# EasyEDA Pro project XRAY.epro, board PCB
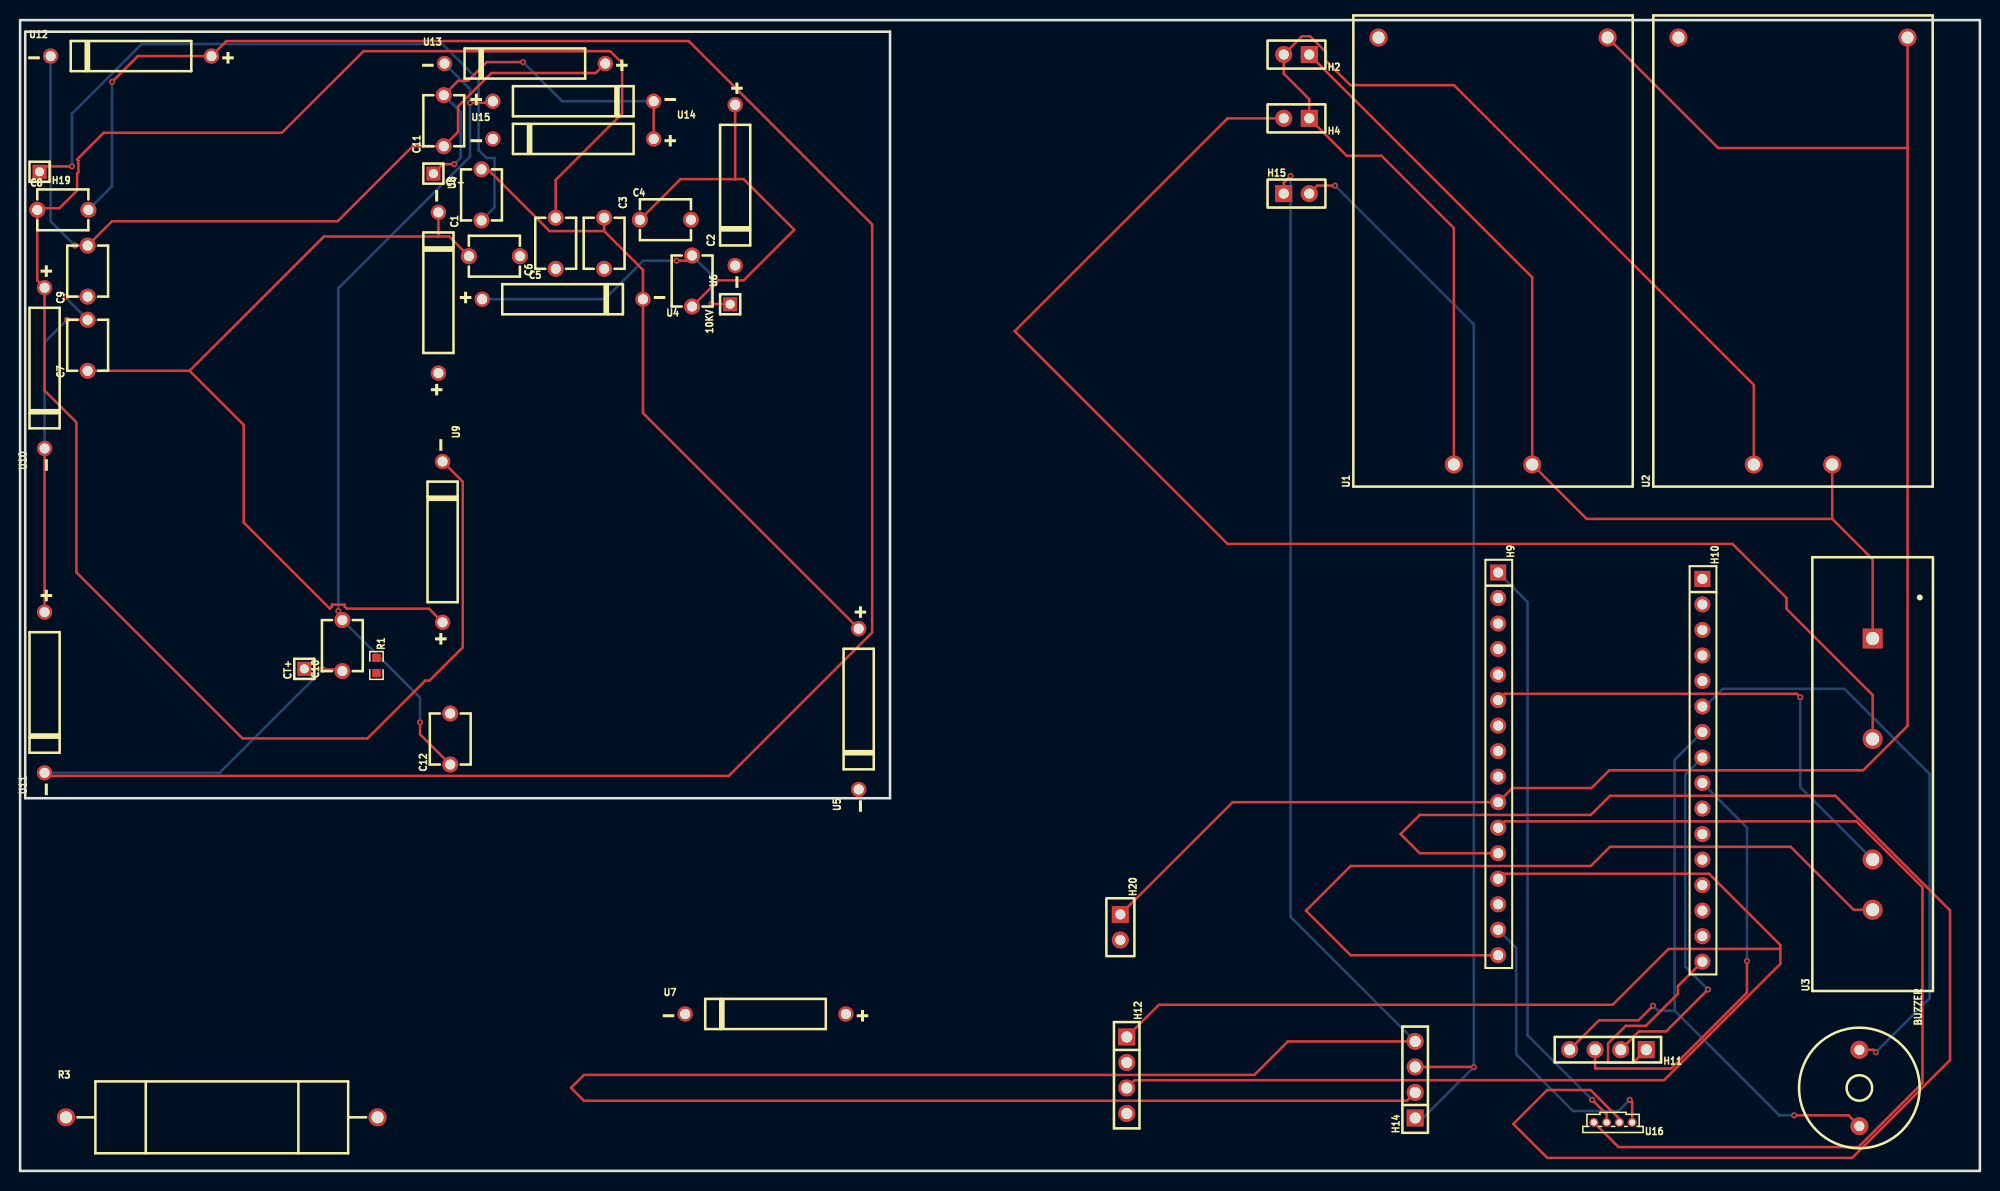
[diagram p7: board, top side]
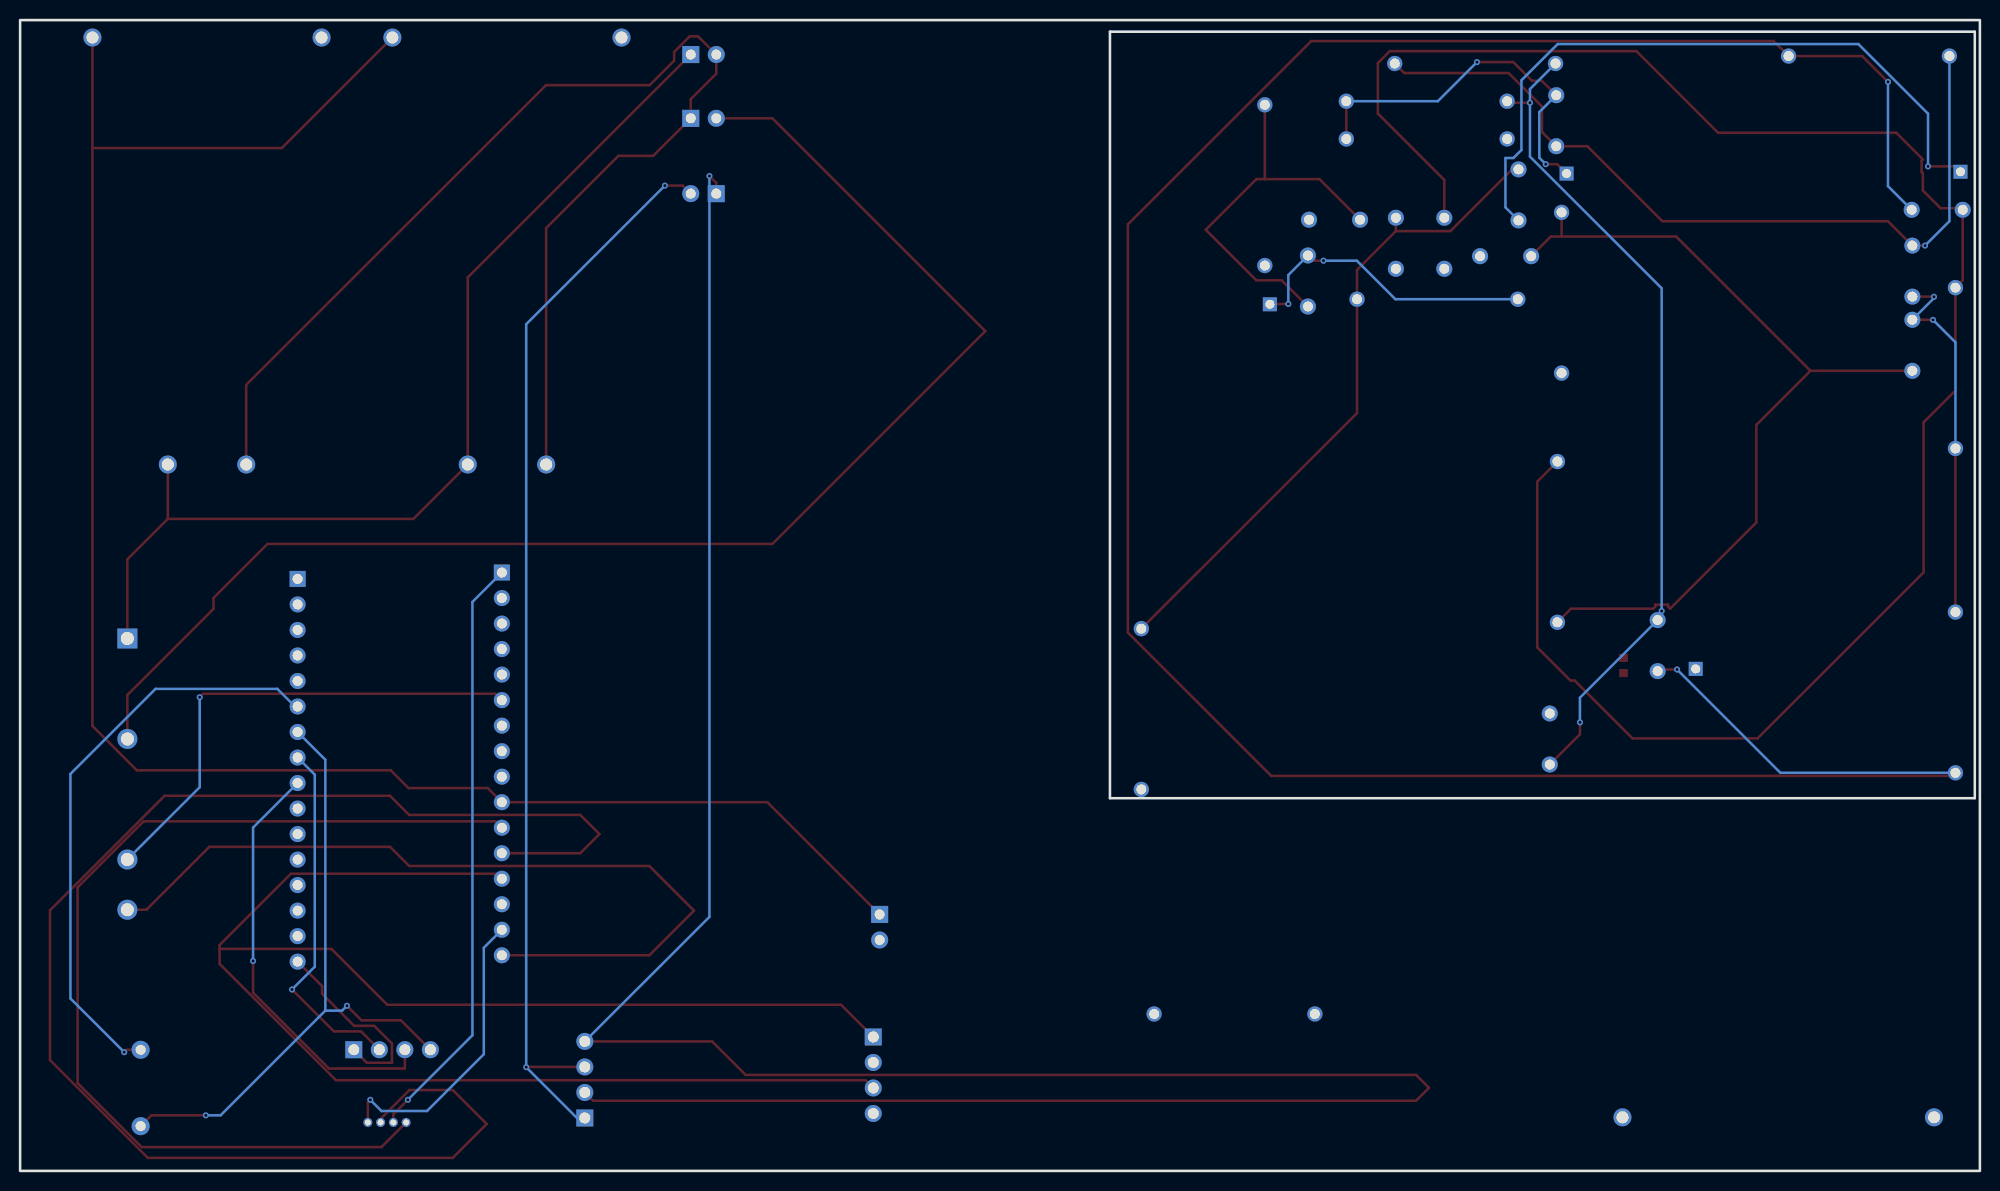
[diagram p8: board, bottom side, seen from below]

Outline 195 x 114.55 mm; copper layers: Top Layer, Bottom Layer. Coordinates in mm from the lower left corner of the outline.
Outline path: rectangle 0,114.55 195,0 ; 0.51,113.4 86.56,113.4 86.56,37.1 0.51,37.1 0.51,113.4
Stack: Top Layer 0.035mm / Dielectric1 1.51mm FR4 er 4.5 / Bottom Layer 0.035mm

## Design rules (mm)
template: JLCPCB Capability(Two Layers Board)
spacing copperThickness1oz (default): track to track 0.102, other pairs 0.152 to 0.3
spacing copperThickness2oz: track to track 0.203, other pairs 0.152 to 0.3
track width copperThickness1oz (default): min 0.127, default 0.254, max 2.54
track width copperThickness2oz: min 0.203, default 0.254, max 2.54
differential pair differentialPair (default): width min 0.127, default 0.254, max 2.54; gap min 0.152, default 0.152
via viaSize (default): diameter min 0.5, default 0.61, max 10; hole min 0.3, default 0.305, max 6.3

## Placement (name value [footprint] x y rotation side)
10KV  -  [HDR-TH_1P-V-M_XKB_X4611WV-01I-C28D40]  70.65 86.27 90 top
BUZZER  2300Hz  [BUZ-TH_BD12.0-P7.60-D0.6-FD]  183.01 8.25 270 top
C1  30KV102K  [CAP-TH_L5.0-W4.0-P5.00-D1.0]  45.91 97.15 90 top
C2  30KV102K  [CAP-TH_L5.0-W4.0-P5.00-D1.0]  66.86 88.58 270 top
C3  30KV102K  [CAP-TH_L5.0-W4.0-P5.00-D1.0]  58.11 92.34 270 top
C4  30KV102K  [CAP-TH_L5.0-W4.0-P5.00-D1.0]  64.21 94.68 0 top
C5  30KV102K  [CAP-TH_L5.0-W4.0-P5.00-D1.0]  47.19 91.05 180 top
C6  30KV102K  [CAP-TH_L5.0-W4.0-P5.00-D1.0]  53.29 92.34 90 top
C7  30KV102K  [CAP-TH_L5.0-W4.0-P5.00-D1.0]  6.72 82.18 90 top
C8  30KV102K  [CAP-TH_L5.0-W4.0-P5.00-D1.0]  4.25 95.67 0 top
C9  30KV102K  [CAP-TH_L5.0-W4.0-P5.00-D1.0]  6.72 89.57 90 top
C10  30KV102K  [CAP-TH_L5.0-W4.0-P5.00-D1.0]  32.06 52.29 90 top
C11  30KV102K  [CAP-TH_L5.0-W4.0-P5.00-D1.0]  42.15 104.54 90 top
C12  30KV102K  [CAP-TH_L5.0-W4.0-P5.00-D1.0]  42.8 42.99 90 top
CT+  -  [HDR-TH_1P-V-M_XKB_X4611WV-01I-C28D40]  28.28 49.98 90 top
CT-  -  [HDR-TH_1P-V-M_XKB_X4611WV-01I-C28D40]  41.12 99.27 180 top
H2  -  [HDR-TH_2P-P2.54-V-F]  127 111.12 180 top
H4  -  [HDR-TH_2P-P2.54-V-F]  127 104.77 180 top
H9  ESP32C3-R  [HDR-TH_16P-P2.54-V-F]  147.07 40.51 270 top
H10  ESP2C3-L  [HDR-TH_16P-P2.54-V-F]  167.39 39.88 270 top
H11  串口  [HDR-TH_4P-P2.54-V-F]  157.99 12.06 180 top
H12  -  [HDR-TH_4P-P2.54-V-F]  110.11 9.53 270 top
H14  -  [HDR-TH_4P-P2.54-V-F]  138.81 9.08 90 top
H15  灯丝输出  [HDR-TH_2P-P2.54-V-F]  127 97.28 0 top
H19  10KV  [HDR-TH_1P-V-M_XKB_X4611WV-01I-C28D40]  1.93 99.45 180 top
H20  灯丝驱动电源  [HDR-TH_2P-P2.54-V-F]  109.47 24.26 270 top
R1  120K  [R0603]  35.46 50.31 270 top
R3  20G  [RES-TH_BD7.0-L25.0-P31.00-D1.0]  20.07 5.33 0 top
U1  HLK-10M03  [PWRM-TH_HLK-10M05]  146.56 91.57 90 top
U2  HLK-10M03  [PWRM-TH_HLK-10M05]  176.4 91.57 90 top
U3  PMN5D6132  [DIP-4_L43.2-W12.0-PMN5A2032]  184.33 39.5 90 top
U4  2CL77  [DIO-TH_BD3.0-L12.0-P16.00-D0.6]  53.98 86.77 180 top
U5  2CL77  [DIO-TH_BD3.0-L12.0-P16.00-D0.6]  83.44 45.97 90 top
U6  2CL77  [DIO-TH_BD3.0-L12.0-P16.00-D0.6]  71.15 98.12 90 top
U7  2CL77  [DIO-TH_BD3.0-L12.0-P16.00-D0.6]  74.17 15.62 0 top
U8  2CL77  [DIO-TH_BD3.0-L12.0-P16.00-D0.6]  41.62 87.42 270 top
U9  2CL77  [DIO-TH_BD3.0-L12.0-P16.00-D0.6]  42.04 62.61 270 top
U10  2CL77  [DIO-TH_BD3.0-L12.0-P16.00-D0.6]  2.43 79.92 90 top
U11  2CL77  [DIO-TH_BD3.0-L12.0-P16.00-D0.6]  2.43 47.63 90 top
U12  2CL77  [DIO-TH_BD3.0-L12.0-P16.00-D0.6]  11.04 110.97 0 top
U13  2CL77  [DIO-TH_BD3.0-L12.0-P16.00-D0.6]  50.22 110.23 0 top
U14  2CL77  [DIO-TH_BD3.0-L12.0-P16.00-D0.6]  55.04 106.48 180 top
U15  2CL77  [DIO-TH_BD3.0-L12.0-P16.00-D0.6]  55.04 102.72 0 top
U16  AHT25  [SENSOR-TH_AHT25]  158.5 4.83 180 top

## Footprints (pads in the part's own frame, mm; a bottom-side part is the same pattern mirrored in y, then rotated)
BUZ-TH_BD12.0-P7.60-D0.6-FD
  round 1.8 hole 1: 1(-3.8,0) 2(3.8,0)
CAP-TH_L5.0-W4.0-P5.00-D1.0
  round 1.6 hole 1: 1(-2.54,0) 2(2.54,0)
DIO-TH_BD3.0-L12.0-P16.00-D0.6
  round 1.524 hole 1: 1(-8,0) 2(8,0)
DIP-4_L43.2-W12.0-PMN5A2032
  rect 2x2 hole 1.3: 1(13.5,0)
  round 2 hole 1.3: 2(3.5,0) 3(-8.5,0) 4(-13.5,0)
HDR-TH_1P-V-M_XKB_X4611WV-01I-C28D40
  rect 1.4x1.4 hole 0.9: 1(0,0)
HDR-TH_2P-P2.54-V-F
  rect 1.7x1.7 hole 1: 1(-1.27,0)
  round 1.7 hole 1: 2(1.27,0)
HDR-TH_4P-P2.54-V-F
  rect 1.7x1.7 hole 1.1: 1(-3.81,0)
  round 1.7 hole 1.1: 2(-1.27,0) 3(1.27,0) 4(3.81,0)
HDR-TH_16P-P2.54-V-F
  rect 1.6x1.6 hole 1: 1(-19.05,0)
  round 1.6 hole 1: 2(-16.51,0) 3(-13.97,0) 4(-11.43,0) 5(-8.89,0) 6(-6.35,0) 7(-3.81,0) 8(-1.27,0) 9(1.27,0) 10(3.81,0) 11(6.35,0) 12(8.89,0) 13(11.43,0) 14(13.97,0) 15(16.51,0) 16(19.05,0)
PWRM-TH_HLK-10M05
  round 1.8 hole 1.2: 1(-21.25,3.9) 2(-21.25,-3.9) 3(21.25,11.4) 4(21.25,-11.4)
R0603
  rect 0.806x0.864 smd: 1(-0.753,0) 2(0.753,0)
RES-TH_BD7.0-L25.0-P31.00-D1.0
  round 1.8 hole 1.2: 1(-15.5,0) 2(15.5,0)
SENSOR-TH_AHT25
  round 0.9 hole 0.6: 1(-1.905,0) 2(-0.635,0) 3(0.635,0) 4(1.905,0)

## Nets
3.3V: H9.10 H20.1 U1.4 U2.4
3.3V-SW: H9.13 H12.1 H12.3
220V-SW: H9.6 U3.3
GND: H9.16 H20.2 R1.2 U1.3 U2.3 U3.4
120KV+: C12.2 CT+.1 R3.2 U15.1
120KV-DET: H10.2 R1.1 R3.1
$1N1416: H4.2 U3.2
$1N2335: C2.2 C4.1 U5.1 U6.2
$1N2339: C1.2 C3.1 U4.1 U5.2
$1N2611: C4.2 C6.1 U7.1 U8.2
$1N2615: C3.2 C5.1 U6.1 U7.2
$1N2617: C6.2 C8.1 U9.1 U10.2
$1N2623: C5.2 C7.1 U8.1 U9.2
$1N2899: C8.2 C10.1 U11.1 U12.2
$1N2903: C7.2 C9.1 U10.1 U11.2
$1N2905: C10.2 C12.1 U13.1 U14.2
$1N2911: C9.2 C11.1 U12.1 U13.2
$1N2933: 10KV.1 C2.1 U4.2
$1N2946: C1.1 H19.1
$1N3033: C11.2 CT-.1 U14.1 U15.2
$1N4648: H10.16 H11.1
$1N4656: H10.8 H11.2
$1N4664: H10.9 H11.3
$1N4672: BUZZER.2 H10.7 H11.4
$1N5062: H14.2 H14.4 H15.1
$1N5074: H14.1 H14.3 H15.2
$1N11280: H2.1 U1.2 U2.2 U3.1
$1N11281: H2.2 H4.1 U1.1 U2.1
$1N12469: H9.15 U16.1
$1N12482: H9.12 U16.2
$1N12487: H9.11 U16.4
$1N12492: H9.1 U16.3
$1N12533: BUZZER.1 H10.6

Pads without a net: H9 2 3 4 5 7 8 9 14; H10 1 3 4 5 10 11 12 13 14 15; H12 2 4

## Via types
v1: diameter 0.61, hole 0.305, Top Layer to Bottom Layer, 24 vias

## Routing (per net, layer and track width the routed paths; a pad name or vN(x,y) marks a point on that pad's centre or on a via; arc(x,y) is an arc through that point)
3.3V: length 189
  Top Layer w0.254: 187.8,101.82 187.8,44.29 183.39,39.88 158.12,39.88 156.35,38.11 148.47,38.11 H9.10 120.65,36.7 H20.1 ; 187.8,101.82 168.96,101.82 U1.4 ; 187.8,101.82 U2.4
3.3V-SW: length 171.9
  Top Layer w0.254: H9.13 147.56,29.58 168.05,29.58 175.15,22.49 175.15,22.1 ; 175.15,22.1 164.02,22.1 158.46,16.54 113.31,16.54 H12.1 ; 175.15,22.1 175.15,20.61 163.56,9.03 110.88,9.03 H12.3
220V-SW: length 49.6
  Top Layer w0.254: v1(177.13,47.15) 176.78,47.5 147.7,47.5 H9.6
  Bottom Layer w0.254: v1(177.13,47.15) 177.13,38.2 U3.3
GND: length 82.6
  Top Layer w0.254: H9.16 132.39,21.46 127.94,25.91 132.39,30.35 156.28,30.35 158.19,32.26 176.17,32.26 182.43,26 U3.4
$1N1416: length 140.9
  Top Layer w0.254: U3.2 184.33,47.37 175.76,55.94 175.76,57.03 170.38,62.41 120.14,62.41 98.96,83.59 120.14,104.77 H4.2
$1N2335: length 39.8
  Top Layer w0.254: C2.2 69.47,88.65 71.99,88.65 77.03,93.68 71.99,98.72 71.15,98.72 ; 61.67,94.68 65.71,98.72 71.15,98.72 ; U6.2 71.15,98.72
$1N2339: length 66.1
  Top Layer w0.254: U5.2 61.98,75.44 U4.1 61.98,89.68 58.11,93.55 ; 58.11,93.55 C3.1 ; 58.11,93.55 52.68,93.55 46.54,99.69 C1.2
$1N2617: length 191.3
  Top Layer w0.254: C6.2 53.29,98.64 59.9,105.25 59.9,110.27 58.72,111.46 34.17,111.46 26.05,103.34 8.32,103.34 5.67,100.69 5.8,100.57 5.8,99.42 5.67,99.29 5.67,97.59 3.91,95.83 1.87,95.83 C8.1 1.71,88.64 U10.2 2.43,77.68 5.6,74.51 5.6,59.57 22.13,43.05 34.56,43.05 40.32,48.81 40.74,48.81 44.04,52.11 44.04,68.6 U9.1
$1N2623: length 88.5
  Top Layer w0.254: 41.62,93.01 30.23,93.01 16.86,79.64 ; 41.62,93.01 42.69,93.01 44.65,91.05 ; 41.62,93.01 U8.1 ; U9.2 40.68,55.96 32.5,55.96 32.3,56.17 32.3,56.37 31.03,56.37 31.03,56.17 30.83,55.96 22.25,64.54 22.25,74.26 16.86,79.64 ; 16.86,79.64 C7.1
$1N2899: length 261.6
  Top Layer w0.254: C10.1 31.9,49.91 v1(30.13,49.91) ; v1(9.15,108.41) 11.71,110.97 U12.2 20.53,112.47 66.53,112.47 84.78,94.22 84.78,53.59 70.51,39.32 2.74,39.32 U11.1
  Bottom Layer w0.254: C8.2 9.15,98.02 v1(9.15,108.41) ; v1(30.13,49.91) 19.85,39.63 U11.1
$1N2903: length 37.4
  Top Layer w0.254: v1(4.66,84.71) 4.68,84.72 C7.2 ; U10.1 U11.2 ; C9.1 4.58,87.03 v1(4.57,87.01)
  Bottom Layer w0.254: U10.1 2.43,82.48 v1(4.66,84.71) ; C7.2 4.57,86.87 v1(4.57,87.01)
$1N2905: length 83.2
  Top Layer w0.254: v1(39.8,44.65) 39.8,43.46 C12.1 ; v1(31.66,55.73) 31.66,55.23 C10.2 ; U14.2 46.89,106.33 v1(44.77,106.33)
  Bottom Layer w0.254: C10.2 39.8,47.1 v1(39.8,44.65) ; v1(31.66,55.73) 31.66,87.86 44.77,100.97 v1(44.77,106.33) 44.77,107.69 U13.1
$1N2911: length 81.6
  Top Layer w0.254: U13.2 57.28,109.28 46.89,109.28 43.58,105.97 43.58,103.42 C11.1 39.06,102 31.6,94.54 9.15,94.54 C9.2 v1(5.46,92.11)
  Bottom Layer w0.254: v1(5.46,92.11) 3.04,94.53 U12.1
$1N2933: length 30.2
  Top Layer w0.254: v1(65.31,90.6) 66.34,90.6 C2.1 ; v1(68.81,86.29) 70.62,86.29 10KV.1
  Bottom Layer w0.254: U4.2 58.16,86.77 61.99,90.6 v1(65.31,90.6) ; v1(68.81,86.29) 68.81,89.18 C2.1
$1N2946: length 69.1
  Top Layer w0.254: H19.1 2.47,99.99 v1(5.16,99.99)
  Bottom Layer w0.254: v1(5.16,99.99) 5.16,105.24 12.09,112.17 42.01,112.17 45.61,108.56 45.61,101.62 46.41,100.83 47.21,100.83 47.21,95.91 C1.1
$1N3033: length 37.9
  Top Layer w0.254: C11.2 43.59,108.51 44.56,108.51 46.43,110.37 v1(50.04,110.37) ; v1(43.2,100.21) 42.06,100.21 CT-.1 ; U14.1 63.04,102.72
  Bottom Layer w0.254: v1(50.04,110.37) 53.94,106.48 U14.1 ; C11.2 43.84,105.4 43.84,100.85 v1(43.2,100.21)
$1N4648: length 19.5
  Top Layer w0.254: H11.1 160.5,10.77 158,10.77 158,12.68 159.76,14.44 161.76,14.44 164.95,17.63 164.95,18.4 167.39,20.83
$1N4656: length 35.9
  Top Layer w0.254: H11.2 161.08,13.89 163.78,13.89 v1(167.94,18.06)
  Bottom Layer w0.254: v1(167.94,18.06) 165.68,20.32 165.68,39.44 167.39,41.15
$1N4664: length 42.8
  Top Layer w0.254: H11.3 156.72,10.19 164.27,10.19 171.82,17.74 v1(171.82,20.9)
  Bottom Layer w0.254: v1(171.82,20.9) 171.82,34.17 H10.9
$1N4672: length 64.5
  Top Layer w0.254: H11.4 157.1,14.99 161.03,14.99 v1(162.48,16.44) ; BUZZER.2 181.93,5.53 v1(176.52,5.53)
  Bottom Layer w0.254: v1(176.52,5.53) 175.05,5.53 164.63,15.95 ; 164.63,15.95 164.63,40.93 H10.7 ; 164.63,15.95 162.96,15.95 v1(162.48,16.44)
$1N5062: length 264.1
  Top Layer w0.254: H14.2 137.99,6.98 56.1,6.98 54.82,8.27 56.1,9.55 122.8,9.55 126.14,12.89 H14.4 ; H15.1 125.73,98.35 v1(126.41,99.03)
  Bottom Layer w0.254: H14.4 126.41,25.29 v1(126.41,99.03)
$1N5074: length 110.1
  Top Layer w0.254: v1(130.84,98.08) 129.06,98.08 H15.2 ; H14.3 144.62,10.35 v1(144.64,10.32)
  Bottom Layer w0.254: v1(130.84,98.08) 144.64,84.28 v1(144.64,10.32) 139.59,5.27 H14.1
$1N11280: length 101.1
  Top Layer w0.254: 180.3,64.9 155.87,64.9 U1.2 150.46,88.94 H2.1 ; 180.3,64.9 184.33,60.88 U3.1 ; 180.3,64.9 U2.2
$1N11281: length 120.2
  Top Layer w0.254: U1.1 142.66,93.85 135.46,101.04 132,101.04 H4.1 128.27,106.68 125.73,109.22 H2.2 127.54,112.94 128.36,112.94 129.93,111.37 129.93,110.51 132.36,108.08 142.67,108.08 172.5,78.24 U2.1
$1N12469: length 29.6
  Top Layer w0.254: U16.1 160.4,6.83 v1(160.16,7.08)
  Bottom Layer w0.254: v1(160.16,7.08) 159.04,5.96 154.51,5.96 148.87,11.61 148.87,22.2 H9.15
$1N12482: length 148.8
  Top Layer w0.254: H9.12 139.26,31.62 137.36,33.53 139.26,35.43 156.28,35.43 158.19,37.34 180.62,37.34 192.03,25.94 192.03,11.04 182.29,1.3 151.95,1.3 148.57,4.67 151.95,8.05 156.25,8.05 159.13,5.17 159.13,4.83
$1N12487: length 101
  Top Layer w0.254: U16.4 159.04,2.37 182.91,2.37 189.28,8.75 189.28,28.23 182.71,34.8 147.7,34.8 H9.11
$1N12492: length 59.2
  Top Layer w0.254: v1(156.42,7.08) 157.86,5.63 U16.3
  Bottom Layer w0.254: v1(156.42,7.08) 149.99,13.5 149.99,56.64 H9.1
$1N12533: length 58.5
  Top Layer w0.254: BUZZER.1 184.4,12.05 v1(184.64,11.82)
  Bottom Layer w0.254: v1(184.64,11.82) 189.99,17.17 189.99,39.52 181.52,47.98 169.4,47.98 167.65,46.23 167.39,46.23
